# Altium project XE_BIA.PrjPcb
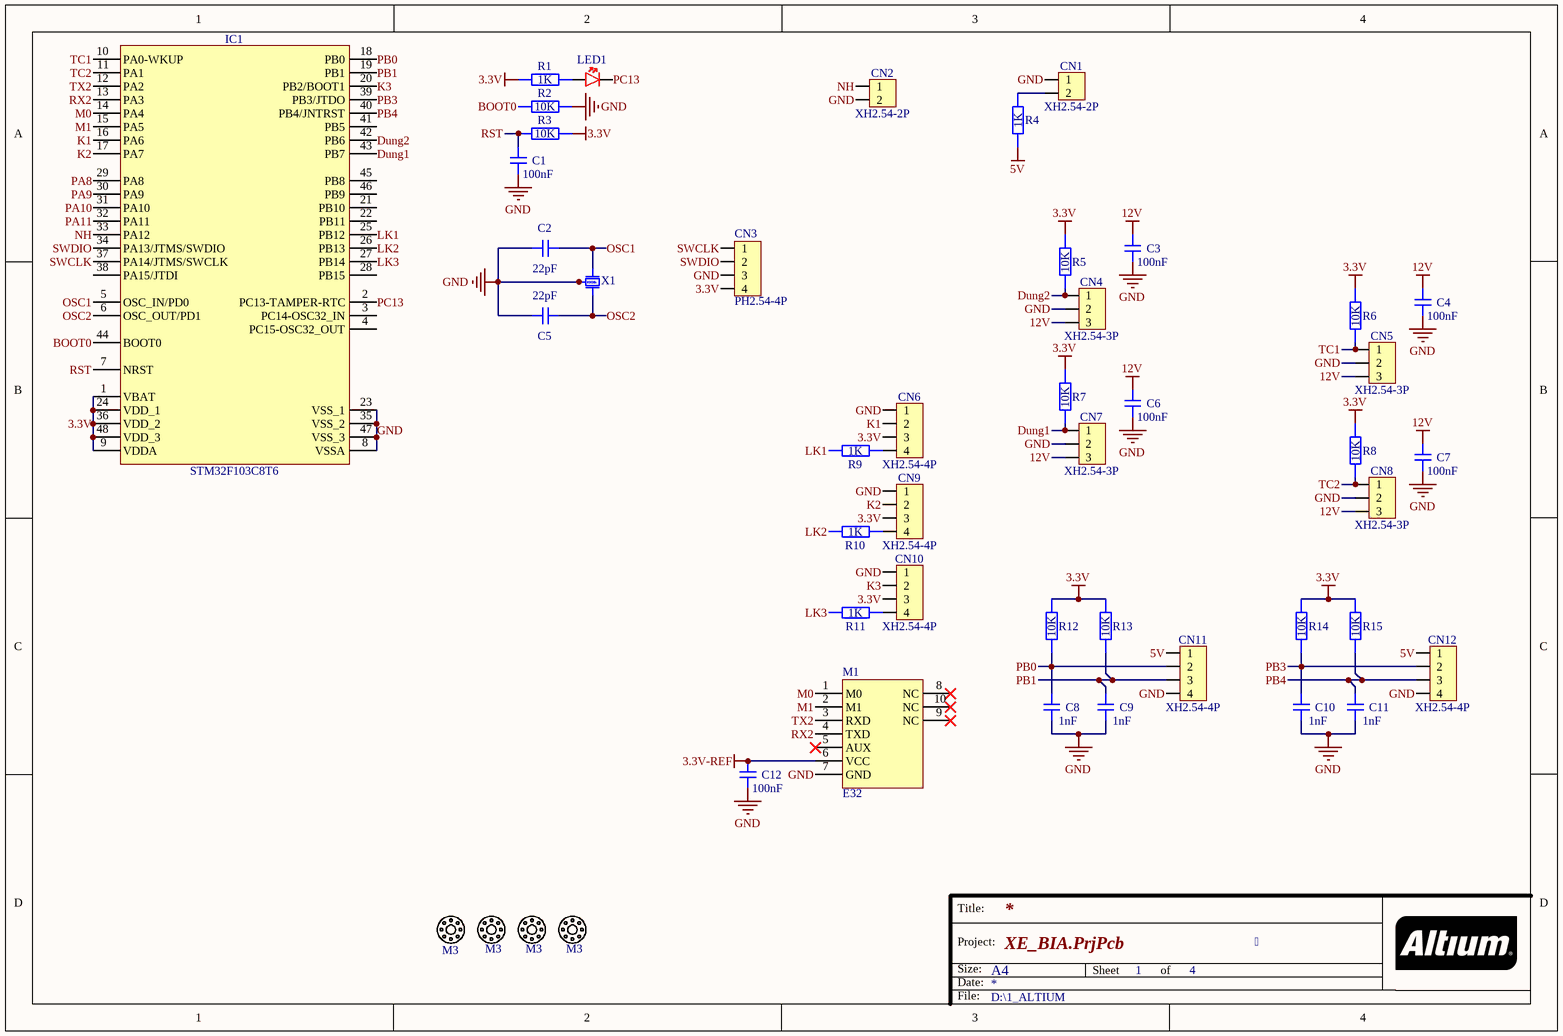
[diagram p0: MCU.SchDoc]
4 sheets, 139 parts. Net scope: global (net labels, ports and power ports of the same name join across sheets).
Board file: PCB.PcbDoc
Sheets:
  MCU.SchDoc
  PWR.SchDoc
  H_BRIGDE.SchDoc
  H_BRIGGE_1.SchDoc

## Sheet MCU.SchDoc
size A4; SheetNumber: 1; SheetTotal: 4

### Parts
1  M3  [Screw hole M3]
2  M3  [Screw hole M3]
3  M3  [Screw hole M3]
4  M3  [Screw hole M3]
C1  100nF  [CAP-0603-2]
C2  22pF  [CAP-0603-2]
C3  100nF  [CAP-0603-2]
C4  100nF  [CAP-0603-2]
C5  22pF  [CAP-0603-2]
C6  100nF  [CAP-0603-2]
C7  100nF  [CAP-0603-2]
C8  1nF  [CAP-0603-2]
C9  1nF  [CAP-0603-2]
C10  1nF  [CAP-0603-2]
C11  1nF  [CAP-0603-2]
C12  100nF  [CAP-0603-2]
CN1  XH2.54-2P  [Plugin,P=2.54mm,2P]
CN2  XH2.54-2P  [Plugin,P=2.54mm,2P]
CN3  PH2.54-4P  [Plugin,P=2.54mm,4P,Pin Headers]
CN4  XH2.54-3P  [Plugin,P=2.54mm,3P]
CN5  XH2.54-3P  [Plugin,P=2.54mm,3P]
CN6  XH2.54-4P  [Plugin,P=2.54mm,4P]
CN7  XH2.54-3P  [Plugin,P=2.54mm,3P]
CN8  XH2.54-3P  [Plugin,P=2.54mm,3P]
CN9  XH2.54-4P  [Plugin,P=2.54mm,4P]
CN10  XH2.54-4P  [Plugin,P=2.54mm,4P]
CN11  XH2.54-4P  [Plugin,P=2.54mm,4P]
CN12  XH2.54-4P  [Plugin,P=2.54mm,4P]
IC1  STM32F103C8T6  [LQFP-48(7x7)]
LED1  RED  [LED-0603]  (value not drawn)
M1  E32  [E32-TTL-100]
R1  1K  [RES-0603-1]
R2  10K  [RES-0603-1]
R3  10K  [RES-0603-1]
R4  1K  [RES-0603-1]
R5  10K  [RES-0603-1]
R6  10K  [RES-0603-1]
R7  10K  [RES-0603-1]
R8  10K  [RES-0603-1]
R9  1K  [RES-0603-1]
R10  1K  [RES-0603-1]
R11  1K  [RES-0603-1]
R12  10K  [RES-0603-1]
R13  10K  [RES-0603-1]
R14  10K  [RES-0603-1]
R15  10K  [RES-0603-1]
X1  8MHz  [SMD5032-4P]  (value not drawn)

### Nets
3.3V: CN3.4 CN6.3 CN9.3 CN10.3 IC1.1(VBAT) IC1.9(VDDA) IC1.24(VDD_1) IC1.36(VDD_2) IC1.48(VDD_3) R1.1 R3.2 R5.2 R6.2 R7.2 R8.2 R12.2 R13.2 R14.2 R15.2
3.3V-REF: C12.1 M1.6(VCC)
5V: CN11.1 CN12.1 R4.1
12V: C3.1 C4.1 C6.1 C7.1 CN4.3 CN5.3 CN7.3 CN8.3
GND: C1.2 C2.2 C3.2 C4.2 C5.2 C6.2 C7.2 C8.2 C9.2 C10.2 C11.2 C12.2 CN1.1 CN2.2 CN3.3 CN4.2 CN5.2 CN6.1 CN7.2 CN8.2 CN9.1 CN10.1 CN11.4 CN12.4 IC1.8(VSSA) IC1.23(VSS_1) IC1.35(VSS_2) IC1.47(VSS_3) M1.7(GND) R2.2 X1.2(GND) X1.4(GND)
BOOT0: IC1.44(BOOT0) R2.1
Dung1: CN7.1 IC1.43(PB7) R7.1
Dung2: CN4.1 IC1.42(PB6) R5.1
K1: CN6.2 IC1.16(PA6)
K2: CN9.2 IC1.17(PA7)
K3: CN10.2 IC1.20(PB2/BOOT1)
LK1: IC1.25(PB12) R9.1
LK2: IC1.26(PB13) R10.1
LK3: IC1.27(PB14) R11.1
M0: IC1.14(PA4) M1.1(M0)
M1: IC1.15(PA5) M1.2(M1)
NH: CN2.1 IC1.33(PA12)
OSC1: C2.1 IC1.5(OSC_IN/PD0) X1.1
OSC2: C5.1 IC1.6(OSC_OUT/PD1) X1.3
PA8: IC1.29(PA8)
PA9: IC1.30(PA9)
PA10: IC1.31(PA10)
PA11: IC1.32(PA11)
PB0: C8.1 CN11.2 IC1.18(PB0) R12.1
PB1: C9.1 CN11.3 IC1.19(PB1) R13.1
PB3: C10.1 CN12.2 IC1.39(PB3/JTDO) R14.1
PB4: C11.1 CN12.3 IC1.40(PB4/JNTRST) R15.1
PC13: IC1.2(PC13-TAMPER-RTC) LED1.2(K)
RST: C1.1 IC1.7(NRST) R3.1
RX2: IC1.13(PA3) M1.4(TXD)
SWCLK: CN3.1 IC1.37(PA14/JTMS/SWCLK)
SWDIO: CN3.2 IC1.34(PA13/JTMS/SWDIO)
TC1: CN5.1 IC1.10(PA0-WKUP) R6.1
TC2: CN8.1 IC1.11(PA1) R8.1
TX2: IC1.12(PA2) M1.3(RXD)
NetCN1_2: CN1.2 R4.2
NetCN6_4: CN6.4 R9.2
NetCN9_4: CN9.4 R10.2
NetCN10_4: CN10.4 R11.2
NetLED1_1: LED1.1(A) R1.2

Not connected (* = marked no-connect by the designer): IC1 3(PC14-OSC32_IN) 4(PC15-OSC32_OUT) 21(PB10) 22(PB11) 28(PB15) 38(PA15/JTDI) 41(PB5) 45(PB8) 46(PB9); M1 5(AUX)* 8(NC)* 9(NC)* 10(NC)*

### Notes on the sheet
- Title:
- Size:
- Date:
- Project:
- A4
- Sheet
- of
- File:
- D:\1_ALTIUM

### Library data of the parts
1-4 = Screw hole M3
C1 C3 C4 C6 C7 C12 = CL10B104KB8NNNC: 100nF ±10% 50V Ceramic Capacitor X7R 0603; Manufacturer: Samsung Electro-Mechanics; Package: 0603; LCSC Part #: C1591; Mfr.Part #: CL10B104KB8NNNC; DigiKey Part Number: 1276-1000-2-ND; ComponentLink1Description: Link; ComponentLink1URL: https://www.lcsc.com/product-detail/C1591.html?s_z=n_CL10B104KB8NNC; ComponentLink2Description: Link 1; ComponentLink2URL: https://www.digikey.com/en/products/detail/samsung-electro-mechanics/CL10B104KB8NNNC/3886658?s=N4IgTCBcDaIMIBkCMAGAQqgLAaTQDgDki4QBdAXyA
C2 C5 = CC0603JRNPO9BN220: 22pF ±5% 50V Ceramic Capacitor NP0 0603; Manufacturer: YAGEO; Package: 0603; LCSC Part #: C105620; Mfr.Part #: CC0603JRNPO9BN220; DigiKey Part Number: 311-1062-2-ND; ComponentLink1Description: Link; ComponentLink1URL: https://www.lcsc.com/product-detail/C105620.html?s_z=n_CC0603JRNPO9BN220; ComponentLink2Description: Link 1; ComponentLink2URL: https://www.digikey.com/en/products/detail/yageo/CC0603JRNPO9BN220/302796?s=N4IgTCBcDaIMJwAwDZEGYBSAlAcgBQHkBOAIRzDERAF0BfIA
C8-C11 = CC0603KRX7R9BB102: 1nF ±10% 50V Ceramic Capacitor X7R 0603; Manufacturer: YAGEO; Package: 0603; LCSC Part #: C100040; Mfr.Part #: CC0603KRX7R9BB102; DigiKey Part Number: 311-1080-2-ND; ComponentLink1Description: Link; ComponentLink1URL: https://www.lcsc.com/product-detail/C100040.html?s_z=n_C100040; ComponentLink2Description: Link 1; ComponentLink2URL: https://www.digikey.com/en/products/detail/yageo/CC0603KRX7R9BB102/302814?s=N4IgTCBcDaIMJwAwDZEGYDSAlAGgdiwE4AhYgRkQgF0BfIA
CN1 CN2 = BX-XH2.54-2PZZ: Connector Header 2 position 2.5mm Pitch 3A Through Hole -25℃~+85℃; Manufacturer: Bossie; Mfr.Part #: BX-XH2.54-2PZZ; LCSC Part #: C18077833; Package: Through Hole,P=2.5mm; DigiKey Part Number: NO; ComponentLink1Description: Link; ComponentLink1URL: https://www.lcsc.com/product-detail/C18077833.html?s_z=n_BX-XH2.54-2PZZ
CN3 = PH2.54-1X4P-H25: Pin Header 4 Position 2.54mm Pitch Single Row Through Hole -40℃~+105℃; Manufacturer: JXTCONN; Mfr.Part #: PH2.54-1X4P-H25; DigiKey Part Number: NO; Package: Plugin,P=2.54mm; LCSC Part #: C42431808
CN4 CN5 CN7 CN8 = BX-XH2.54-3PZZ: Connector Header 3 position 2.5mm Pitch 3A Through Hole -25℃~+85℃; Manufacturer: Bossie; Mfr.Part #: BX-XH2.54-3PZZ; LCSC Part #: C18077834; Package: Through Hole,P=2.5mm; DigiKey Part Number: NO; ComponentLink1Description: Link; ComponentLink1URL: https://www.lcsc.com/product-detail/C18077834.html?s_z=n_BX-XH2.54-3PZZ
CN6 CN9-CN12 = BX-XH2.54-4PZZ: Connector Header 4 position 2.5mm Pitch 3A Through Hole -25℃~+85℃; Manufacturer: Bossie; Mfr.Part #: BX-XH2.54-4PZZ; LCSC Part #: C18077835; Package: Through Hole,P=2.5mm; DigiKey Part Number: NO; ComponentLink1Description: Link; ComponentLink1URL: https://www.lcsc.com/product-detail/C18077835.html?s_z=n_BX-XH2.54-4PZZ
IC1 = STM32F103C8T6: ARM Cortex-M3 32 Bit 72MHz 37 LQFP-48(7x7) Microcontrollers RoHS; Manufacturer: ST; Mfr.Part #: STM32F103C8T6; Package: LQFP-48(7x7); LCSC Part #: C8734; DigiKey Part Number: 497-6063-ND; ComponentLink1Description: Link; ComponentLink1URL: https://www.lcsc.com/product-detail/C8734.html?s_z=n_STM32F103C8T6; ComponentLink2Description: Link 1; ComponentLink2URL: https://www.digikey.com/en/products/detail/stmicroelectronics/STM32F103C8T6/1646338
LED1 = YLED0603R: 25mA 1.8V~2.4V Red 0603 LED Indication - Discrete ROHS; Manufacturer: YONGYUTAI; Mfr.Part #: YLED0603R; Package: 0603; LCSC Part #: C19171390; DigiKey Part Number: NO; ComponentLink1Description: Link; ComponentLink1URL: https://www.lcsc.com/product-detail/C19171390.html?s_z=n_C19171390; ComponentLink2Description: Link 1
M1 = E32-TTL-100: E32-TTL-100 is a 100mW wireless transceiver module with LoRa / spread-spectrum technology, operates at 410~441MHz (Default: 433MHz), based on original imported RFIC SX1278 from SEMTECH; Manufacturer: Chengdu Ebyte Electronic; Mfr.Part #: E32-TTL-100; Package: Through Hole,P=2.54mm; LCSC Part #: NO; DigiKey Part Number: NO; ComponentLink1Description: Link; ComponentLink1URL: https://nshopvn.com/product/module-rf-sx1278-lora-e32/
R1 R4 R9-R11 = RC0603FR-071KL: 100mW 1kΩ 75V Thick Film Resistor ±100ppm/℃ ±1% 0603 Chip Resistor - Surface Mount RoHS; Manufacturer: YAGEO; Mfr.Part #: RC0603FR-071KL; Package: 0603; LCSC Part #: C22548; DigiKey Part Number: 311-1.00KHRTR-ND; ComponentLink1Description: Link; ComponentLink1URL: https://www.lcsc.com/product-detail/C22548.html?s_z=n_C22548; ComponentLink2Description: Link 1; ComponentLink2URL: https://www.digikey.com/en/products/detail/yageo/RC0603FR-071KL/726843?s=N4IgTCBcDaIEoGEAMA2JBmAYnAtEg7AIwDSAMiALoC%2BQA
R2 R3 R5-R8 R12-R15 = RC0603FR-0710KL: 100mW 10kΩ 75V Thick Film Resistor ±100ppm/℃ ±1% 0603 Chip Resistor - Surface Mount RoHS; Manufacturer: YAGEO; Package: 0603; LCSC Part #: C98220; Mfr.Part #: RC0603FR-0710KL; DigiKey Part Number: 311-10.0KHRTR-ND; ComponentLink1Description: Link; ComponentLink1URL: https://www.lcsc.com/product-detail/C98220.html?s_z=n_C98220; ComponentLink2Description: Link 1; ComponentLink2URL: https://www.digikey.com/en/products/detail/yageo/RC0603FR-0710KL/726880?s=N4IgTCBcDaIMwEYEFoEAYB0aDSAJASgCr7IByAIiALoC%2BQA
X1 = X50328MSB4SI: Crystal 8MHz ±10ppm 20pF SMD5032-4P; Manufacturer: YXC Crystal Oscillators; Mfr.Part #: X50328MSB4SI; Package: SMD5032-4P; LCSC Part #: C157341; DigiKey Part Number: NO; ComponentLink1Description: Link; ComponentLink1URL: https://www.lcsc.com/product-detail/C157341.html?s_z=n_c157341; ComponentLink2Description: Link 1

## Sheet PWR.SchDoc
size A4; SheetNumber: 2; SheetTotal: 4
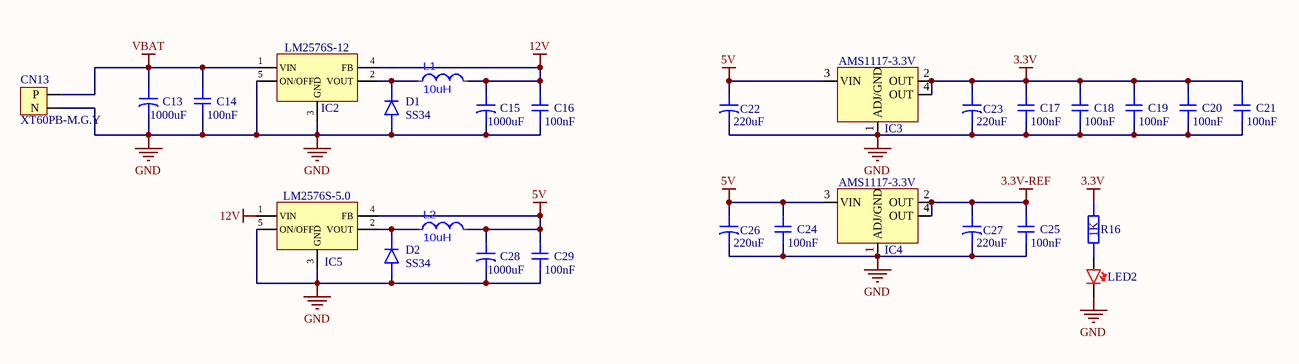
[diagram p1: PWR.SchDoc]

### Parts
C13  1000uF  [Plugin,D10xL20mm]
C14  100nF  [CAP-0603-2]
C15  1000uF  [Plugin,D10xL20mm]
C16  100nF  [CAP-0603-2]
C17  100nF  [CAP-0603-2]
C18  100nF  [CAP-0603-2]
C19  100nF  [CAP-0603-2]
C20  100nF  [CAP-0603-2]
C21  100nF  [CAP-0603-2]
C22  220uF  [PLUGIN,D6.3xL12mm]
C23  220uF  [PLUGIN,D6.3xL12mm]
C24  100nF  [CAP-0603-2]
C25  100nF  [CAP-0603-2]
C26  220uF  [PLUGIN,D6.3xL12mm]
C27  220uF  [PLUGIN,D6.3xL12mm]
C28  1000uF  [Plugin,D10xL20mm]
C29  100nF  [CAP-0603-2]
CN13  XT60PB-M.G.Y  [XT60PB-M.G.Y]
D1  SS34  [SMA(DO-214AC)]
D2  SS34  [SMA(DO-214AC)]
IC2  LM2576S-12  [TO-263-5L]
IC3  AMS1117-3.3V  [SOT-223]
IC4  AMS1117-3.3V  [SOT-223]
IC5  LM2576S-5.0  [TO-263-5L]
L1  10uH  [Inductor 4.5A 10uH 0630]
L2  10uH  [Inductor 4.5A 10uH 0630]
LED2  RED  [LED-0603]  (value not drawn)
R16  1K  [RES-0603-1]

### Nets
3.3V: C17.1 C18.1 C19.1 C20.1 C21.1 C23.1 IC3.2(OUT) IC3.4(OUT) R16.2
3.3V-REF: C25.1 C27.1 IC4.2(OUT) IC4.4(OUT)
5V: C22.1 C24.1 C26.1 C28.1 C29.1 IC3.3(VIN) IC4.3(VIN) IC5.4(FB) L2.2
12V: C15.1 C16.1 IC2.4(FB) IC5.1(VIN) L1.2
GND: C13.2 C14.2 C15.2 C16.2 C17.2 C18.2 C19.2 C20.2 C21.2 C22.2 C23.2 C24.2 C25.2 C26.2 C27.2 C28.2 C29.2 CN13.2(N) D1.1(A) D2.1(A) IC2.3(GND) IC2.5(ON/OFF) IC3.1(ADJ/GND) IC4.1(ADJ/GND) IC5.3(GND) IC5.5(ON/OFF) LED2.2(K)
VBAT: C13.1 C14.1 CN13.1(P) IC2.1(VIN)
NetD1_2: D1.2(K) IC2.2(VOUT) L1.1
NetD2_2: D2.2(K) IC5.2(VOUT) L2.1
NetLED2_1: LED2.1(A) R16.1

### Notes on the sheet
- Title:
- Size:
- Date:
- Project:
- A4
- Sheet
- of
- File:
- D:\1_ALTIUM

### Library data of the parts
C13 C15 C28 = 35PX1000MEFC10X20: 1000uF 35V Aluminum Electrolytic Capacitors Through Hole,D10xL20mm 2000hrs@105℃; Manufacturer: Rubycon; So_Chan_Cam: 2; Mfr.Part #: 35PX1000MEFC10X20; LCSC Part #: C136014; Package: Through Hole,D10xL20mm; DigiKey Part Number: 1189-1745-ND; ComponentLink1Description: Link; ComponentLink1URL: https://www.lcsc.com/product-detail/C136014.html?s_z=n_35PX1000MEFC10X20; ComponentLink2Description: Link 1; ComponentLink2URL: https://www.digikey.com/en/products/detail/rubycon/35PX1000MEFC10X20/3563769?s=N4IgTCBcDaIMwFYAKANAjABiwWQKIDEBhTFMDEAXQF8g
C14 C16-C21 C24 C25 C29 = CL10B104KB8NNNC: as C1 on sheet MCU; Package: 0603; LCSC Part #: C1591; Mfr.Part #: CL10B104KB8NNNC; DigiKey Part Number: 1276-1000-2-ND; ComponentLink1Description: Link; ComponentLink1URL: https://www.lcsc.com/product-detail/C1591.html?s_z=n_CL10B104KB8NNC; ComponentLink2Description: Link 1; ComponentLink2URL: https://www.digikey.com/en/products/detail/samsung-electro-mechanics/CL10B104KB8NNNC/3886658?s=N4IgTCBcDaIMIBkCMAGAQqgLAaTQDgDki4QBdAXyA
C22 C23 C26 C27 = 25YXJ220M6.3X11: 220uF 25V Aluminum Electrolytic Capacitors Through Hole,D6.3xL11mm 7000hrs@105℃; Manufacturer: Rubycon; Mfr.Part #: 25YXJ220M6.3X11; Package: Through Hole,D6.3xL11mm; LCSC Part #: C88729; DigiKey Part Number: 1189-2913-ND; ComponentLink1Description: Link; ComponentLink1URL: https://www.lcsc.com/product-detail/C88729.html; ComponentLink2Description: Link 1; ComponentLink2URL: https://www.digikey.com/en/products/detail/rubycon/25YXJ220M6-3X11/3563124?s=N4IgTCBcDa4KwE0AaApMYAMBZAbAOgGYkBGYkAXQF8g
CN13 = XT60PB-M.G.Y: Power Connectors RoHS; Manufacturer: Changzhou Amass Elec; Mfr.Part #: XT60PB-M.G.Y; LCSC Part #: C19268037; Package: Through Hole; DigiKey Part Number: NO; ComponentLink1Description: Link; ComponentLink1URL: https://www.lcsc.com/product-detail/C19268037.html?s_z=n_xt60; ComponentLink2Description: Link 1
D1 D2 = SS34: Diode Independent 40V 3A Surface Mount SMA(DO-214AC); Manufacturer: GOODWORK; Mfr.Part #: SS34; Package: SMA(DO-214AC); LCSC Part #: C908680; DigiKey Part Number: NO; ComponentLink1Description: Link; ComponentLink1URL: https://www.lcsc.com/product-detail/C908680.html?s_z=n_C908680
IC2 = LM2576S-12: Buck Switching Regulator IC Fixed 12V 1 Output 3A TO-263-5L; Manufacturer: HXY MOSFET; Mfr.Part #: LM2576S-12; Package: TO-263-5L; LCSC Part #: C22386541; DigiKey Part Number: NO
IC3 IC4 = AMS1117-3.3V: Linear Voltage Regulator IC Positive Fixed 1 Output 1A SOT-223; Manufacturer: MSKSEMI; Mfr.Part #: AMS1117-3.3V; Package: SOT-223; LCSC Part #: C5120765; DigiKey Part Number: NO; ComponentLink1Description: Link; ComponentLink1URL: https://www.lcsc.com/product-detail/C5120765.html?s_z=n_C5120765
IC5 = LM2576S-5.0: 47kHz~58kHz Buck Adjustable 3.5A 5V TO-263-5L Voltage Regulators - DC DC Switching Regulators RoHS; Manufacturer: HXY MOSFET; Mfr.Part #: LM2576S-5.0; Package: TO-263-5L; LCSC Part #: C5349983; DigiKey Part Number: NO; ComponentLink1Description: Link; ComponentLink1URL: https://www.lcsc.com/product-detail/C5349983.html?s_z=n_LM2576S-5.0; ComponentLink2Description: Link 1
L1 L2 = Inductor 4.5A 10uH 0630: 4.5A 10uH ±20% 5.5A 68mΩ Molded Inductor SMD,7.3x6.6mm Fixed Inductors RoHS; Manufacturer: Shun Xiang Nuo; MPN: SMMS0630-100M; Key Attributes: FIXED IND 10uH 68mΩ SMD,6.6x7.3mm; ComponentLink1Description: Link; ComponentLink1URL: https://www.lcsc.com/product-detail/C128692.html?s_z=n_q_l_inductor%25200630&spm=wm.fly.bg.1.xh___wm.fly.tp.0.ml&lcsc_vid=Q1VfX1ReRFFaUFJSRgIIUV0CFFgIBFJfT1hdVlwEEVkxVlNRTlNdX1VST1JcVTsOAxUeFF5JWBYZEEoKFBINSQcJGk4%3D; LCSC Part #: C128692; Packaging: SMD,7.3x6.6mm; Link: https://www.lcsc.com/product-detail/C128692.html?s_z=n_q_l_inductor%25200630&spm=wm.fly.bg.1.xh___wm.fly.tp.0.ml&lcsc_vid=Q1VfX1ReRFFaUFJSRgIIUV0CFFgIBFJfT1hdVlwEEVkxVlNRTlNdX1VST1JcVTsOAxUeFF5JWBYZEEoKFBINSQcJGk4%3D; Parameter 7: *
LED2 = YLED0603R: as LED1 on sheet MCU; Mfr.Part #: YLED0603R; Package: 0603; LCSC Part #: C19171390; DigiKey Part Number: NO; ComponentLink1Description: Link; ComponentLink1URL: https://www.lcsc.com/product-detail/C19171390.html?s_z=n_C19171390; ComponentLink2Description: Link 1
R16 = RC0603FR-071KL: as R1 on sheet MCU; Mfr.Part #: RC0603FR-071KL; Package: 0603; LCSC Part #: C22548; DigiKey Part Number: 311-1.00KHRTR-ND; ComponentLink1Description: Link; ComponentLink1URL: https://www.lcsc.com/product-detail/C22548.html?s_z=n_C22548; ComponentLink2Description: Link 1; ComponentLink2URL: https://www.digikey.com/en/products/detail/yageo/RC0603FR-071KL/726843?s=N4IgTCBcDaIEoGEAMA2JBmAYnAtEg7AIwDSAMiALoC%2BQA

## Sheet H_BRIGDE.SchDoc
size A4; SheetNumber: 3; SheetTotal: 4
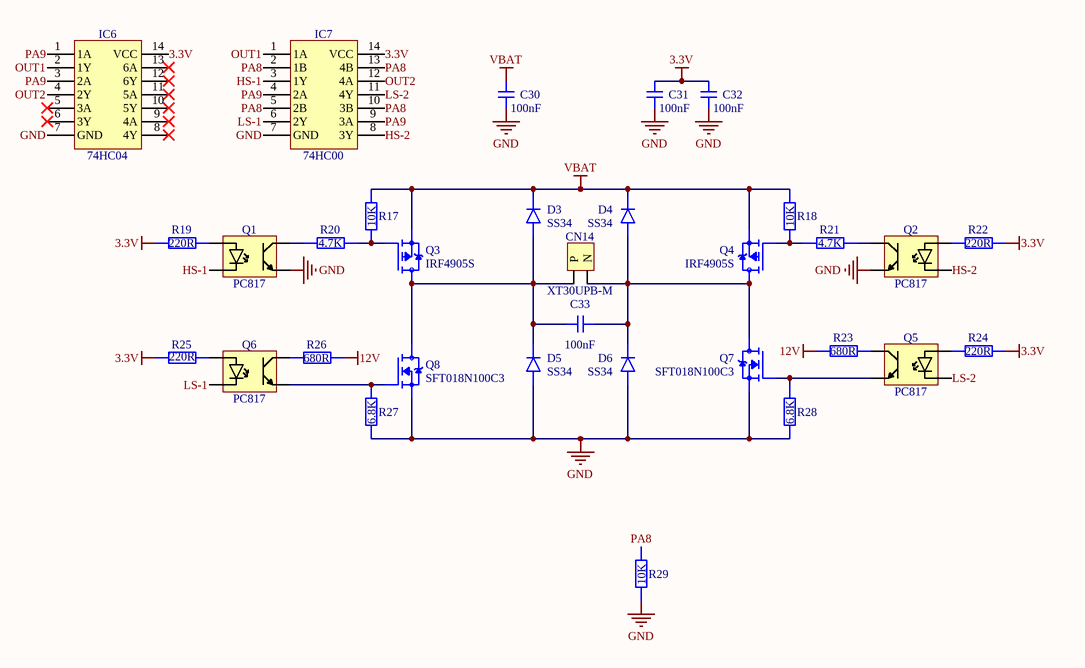
[diagram p2: H_BRIGDE.SchDoc]

### Parts
C30  100nF  [CAP-0603-2]
C31  100nF  [CAP-0603-2]
C32  100nF  [CAP-0603-2]
C33  100nF  [CAP-0603-2]
CN14  XT30UPB-M  [XT30UPB-M]
D3  SS34  [SMA(DO-214AC)]
D4  SS34  [SMA(DO-214AC)]
D5  SS34  [SMA(DO-214AC)]
D6  SS34  [SMA(DO-214AC)]
IC6  74HC04  [SOP-14]
IC7  74HC00  [SOP-14]
Q1  PC817  [SOP-4]
Q2  PC817  [SOP-4]
Q3  IRF4905S  [TO-263]
Q4  IRF4905S  [TO-263]
Q5  PC817  [SOP-4]
Q6  PC817  [SOP-4]
Q7  SFT018N100C3  [TOLL]
Q8  SFT018N100C3  [TOLL]
R17  10K  [RES-0603-1]
R18  10K  [RES-0603-1]
R19  220R  [RES-0603-1]
R20  4.7K  [RES-0603-1]
R21  4.7K  [RES-0603-1]
R22  220R  [RES-0603-1]
R23  680R  [RES-0603-1]
R24  220R  [RES-0603-1]
R25  220R  [RES-0603-1]
R26  680R  [RES-0603-1]
R27  6.8K  [RES-0603-1]
R28  6.8K  [RES-0603-1]
R29  10K  [RES-0603-1]

### Nets
3.3V: C31.1 C32.1 IC6.14(VCC) IC7.14(VCC) R19.2 R22.1 R24.1 R25.2
12V: R23.2 R26.2
GND: C30.2 C31.2 C32.2 D5.1(A) D6.1(A) IC6.7(GND) IC7.7(GND) Q1.3(E) Q2.3(E) Q7.2(S) Q8.2(S) R27.1 R28.1 R29.1
VBAT: C30.1 D3.2(K) D4.2(K) Q3.3(S) Q4.3(S) R17.2 R18.2
HS-1: IC7.3(1Y) Q1.2(K)
HS-2: IC7.8(3Y) Q2.2(K)
LS-1: IC7.6(2Y) Q6.2(K)
LS-2: IC7.11(4Y) Q5.2(K)
OUT1: IC6.2(1Y) IC7.1(1A)
OUT2: IC6.4(2Y) IC7.12(4A)
PA8: IC7.2(1B) IC7.5(2B) IC7.10(3B) IC7.13(4B) R29.2
PA9: IC6.1(1A) IC6.3(2A) IC7.4(2A) IC7.9(3A)
NetC33_1: C33.1 CN14.2(N) D4.1(A) D6.2(K) Q4.2(D) Q7.3(D)
NetC33_2: C33.2 CN14.1(P) D3.1(A) D5.2(K) Q3.2(D) Q8.3(D)
NetQ1_1: Q1.1(A) R19.1
NetQ1_4: Q1.4(C) R20.1
NetQ2_1: Q2.1(A) R22.2
NetQ2_4: Q2.4(C) R21.2
NetQ3_1: Q3.1(G) R17.1 R20.2
NetQ4_1: Q4.1(G) R18.1 R21.1
NetQ5_1: Q5.1(A) R24.2
NetQ5_3: Q5.3(E) Q7.1(G) R28.2
NetQ5_4: Q5.4(C) R23.1
NetQ6_1: Q6.1(A) R25.1
NetQ6_3: Q6.3(E) Q8.1(G) R27.2
NetQ6_4: Q6.4(C) R26.1

Not connected (* = marked no-connect by the designer): IC6 5(3A)* 6(3Y)* 8(4Y)* 9(4A)* 10(5Y)* 11(5A)* 12(6Y)* 13(6A)*

### Notes on the sheet
- Title:
- Size:
- Date:
- Project:
- A4
- Sheet
- of
- File:
- D:\1_ALTIUM

### Library data of the parts
C30-C33 = CL10B104KB8NNNC: as C1 on sheet MCU; Package: 0603; LCSC Part #: C1591; Mfr.Part #: CL10B104KB8NNNC; DigiKey Part Number: 1276-1000-2-ND; ComponentLink1Description: Link; ComponentLink1URL: https://www.lcsc.com/product-detail/C1591.html?s_z=n_CL10B104KB8NNC; ComponentLink2Description: Link 1; ComponentLink2URL: https://www.digikey.com/en/products/detail/samsung-electro-mechanics/CL10B104KB8NNNC/3886658?s=N4IgTCBcDaIMIBkCMAGAQqgLAaTQDgDki4QBdAXyA
CN14 = XT30UPB-M: Banana and Tip Connector Adapters; Manufacturer: Changzhou Amass Elec; Mfr.Part #: XT30PW-M30.G.Y; LCSC Part #: C428721; Package: Through Hole; DigiKey Part Number: NO; ComponentLink1Description: Link; ComponentLink1URL: https://www.lcsc.com/product-detail/C431092.html?s_z=n_xt30; ComponentLink2Description: Link 1
D3-D6 = SS34: as D1 on sheet PWR; Mfr.Part #: SS34; Package: SMA(DO-214AC); LCSC Part #: C908680; DigiKey Part Number: NO; ComponentLink1Description: Link; ComponentLink1URL: https://www.lcsc.com/product-detail/C908680.html?s_z=n_C908680
IC6 = SN74HC04DR: 2V~6V 16ns@6V,50pF 2uA 6 1 SOIC-14 Gates and Inverters RoHS; Manufacturer: TI; Mfr.Part #: SN74HC04DR; Package: SOIC-14; LCSC Part #: C6811; DigiKey Part Number: 296-1189-2-ND; ComponentLink1Description: Link; ComponentLink1URL: https://www.lcsc.com/product-detail/C6811.html?s_z=n_74HC04; ComponentLink2Description: Link 1; ComponentLink2URL: https://www.digikey.com/en/products/detail/texas-instruments/SN74HC04DR/276832
IC7 = SN74HC00DR: 2uA 2V~6V 15ns@6V,50pF SOIC-14 Gates and Inverters RoHS; Manufacturer: TI; Mfr.Part #: SN74HC00DR; Package: SOIC-14; LCSC Part #: C10090; DigiKey Part Number: 296-1187-2-ND; ComponentLink1Description: Link; ComponentLink1URL: https://www.lcsc.com/product-detail/C10090.html?s_z=n_74hc00; ComponentLink2Description: Link 1; ComponentLink2URL: https://www.digikey.com/en/products/detail/texas-instruments/SN74HC00DR/276830
Q1 Q2 Q5 Q6 = PC817C-S: Phototransistor Output 5kVrms 1 Channel SOP-4-2.54mm; Manufacturer: UMW; Mfr.Part #: PC817C-S; Package: SOP-4-2.54mm; LCSC Part #: C3008369; DigiKey Part Number: NO; ComponentLink1Description: Link; ComponentLink1URL: https://www.lcsc.com/product-detail/C3008369.html?s_z=n_C3008369; ComponentLink2Description: Link 1
Q3 Q4 = IRF4905STRLPBF: P-Channel 55V 70A 170W Surface Mount D2PAK; Manufacturer: Infineon; Package: D2PAK; Mfr.Part #: IRF4905STRLPBF; LCSC Part #: C2620; DigiKey Part Number: IRF4905STRLPBFTR-ND; ComponentLink1Description: Link; ComponentLink1URL: https://www.lcsc.com/product-detail/C2620.html?s_z=n_IRF4905S; ComponentLink2Description: Link 1; ComponentLink2URL: https://www.digikey.com/en/products/detail/infineon-technologies/IRF4905STRLPBF/1928283?s=N4IgTCBcDaIJICUBiAWAnABgKwGUAqCAMgAoBCSIAugL5A
Q7 Q8 = SFT018N100C3: N-Channel 100V 320A 312W Surface Mount TOLL; Manufacturer: SCILICON; Package: TOLL; Mfr.Part #: SFT018N100C3; LCSC Part #: C42395330; DigiKey Part Number: NO; ComponentLink1Description: Link; ComponentLink1URL: https://www.lcsc.com/product-detail/C42395330.html?s_z=n_c42395330; ComponentLink2Description: Link 1
R17 R18 R29 = RC0603FR-0710KL: as R2 on sheet MCU; Package: 0603; LCSC Part #: C98220; Mfr.Part #: RC0603FR-0710KL; DigiKey Part Number: 311-10.0KHRTR-ND; ComponentLink1Description: Link; ComponentLink1URL: https://www.lcsc.com/product-detail/C98220.html?s_z=n_C98220; ComponentLink2Description: Link 1; ComponentLink2URL: https://www.digikey.com/en/products/detail/yageo/RC0603FR-0710KL/726880?s=N4IgTCBcDaIMwEYEFoEAYB0aDSAJASgCr7IByAIiALoC%2BQA
R19 R22 R24 R25 = 0603WAF2200T5E: 220Ω ±1% 100mW 0603 Thick Film Resistor; Manufacturer: UNI-ROYAL; Mfr.Part #: 0603WAF2200T5E; Package: 0603; LCSC Part #: C22962; DigiKey Part Number: NO; ComponentLink1Description: Link; ComponentLink1URL: https://www.lcsc.com/product-detail/C22962.html?s_z=n_0603waf22; ComponentLink2Description: Link 1
R20 R21 = RC0603FR-074K7L: 100mW 4.7kΩ 75V Thick Film Resistor ±100ppm/℃ ±1% 0603 Chip Resistor - Surface Mount RoHS; Manufacturer: YAGEO; Mfr.Part #: RC0603FR-074K7L; Package: 0603; LCSC Part #: C99782; DigiKey Part Number: 311-4.70KHRTR-ND; ComponentLink1Description: Link; ComponentLink1URL: https://www.lcsc.com/product-detail/C99782.html?s_z=n_4.7K; ComponentLink2Description: Link 1; ComponentLink2URL: https://www.digikey.com/en/products/detail/yageo/RC0603FR-074K7L/727212?s=N4IgTCBcDaIEoGEAMA2JBmAYnAtEg7ACwDS%2BAMiALoC%2BQA
R23 R26 = FRC0603F6800TS: 680Ω ±1% 100mW 0603 Thick Film Resistor; Manufacturer: FOJAN; Mfr.Part #: FRC0603F6800TS; Package: 0603; LCSC Part #: C2907062; DigiKey Part Number: NO; ComponentLink1Description: Link; ComponentLink1URL: https://www.lcsc.com/product-detail/C2907062.html?s_z=n_680r; ComponentLink2Description: Link 1
R27 R28 = 0603WAF6801T5E: 6.8kΩ ±1% 100mW 0603 Thick Film Resistor; Manufacturer: UNI-ROYAL; Mfr.Part #: 0603WAF6801T5E; Package: 0603; LCSC Part #: C23212; DigiKey Part Number: NO; ComponentLink1Description: Link; ComponentLink1URL: https://www.lcsc.com/product-detail/C23212.html?s_z=n_C23212; ComponentLink2Description: Link 1

## Sheet H_BRIGGE_1.SchDoc
size A; SheetNumber: 4; SheetTotal: 4
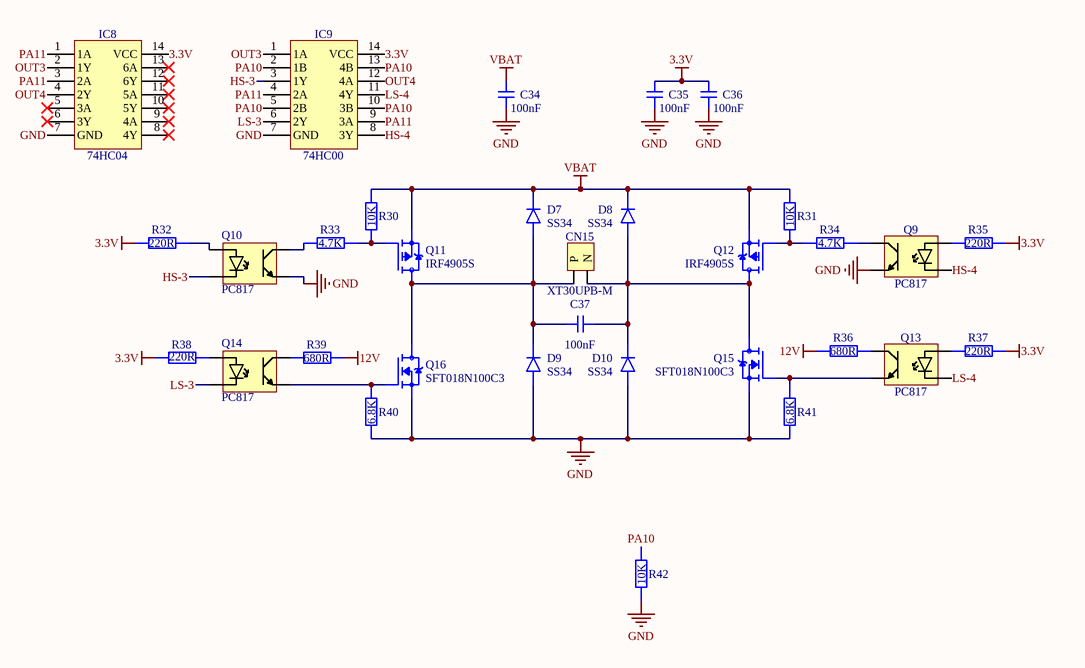
[diagram p3: H_BRIGGE_1.SchDoc]

### Parts
C34  100nF  [CAP-0603-2]
C35  100nF  [CAP-0603-2]
C36  100nF  [CAP-0603-2]
C37  100nF  [CAP-0603-2]
CN15  XT30UPB-M  [XT30UPB-M]
D7  SS34  [SMA(DO-214AC)]
D8  SS34  [SMA(DO-214AC)]
D9  SS34  [SMA(DO-214AC)]
D10  SS34  [SMA(DO-214AC)]
IC8  74HC04  [SOP-14]
IC9  74HC00  [SOP-14]
Q9  PC817  [SOP-4]
Q10  PC817  [SOP-4]
Q11  IRF4905S  [TO-263]
Q12  IRF4905S  [TO-263]
Q13  PC817  [SOP-4]
Q14  PC817  [SOP-4]
Q15  SFT018N100C3  [TOLL]
Q16  SFT018N100C3  [TOLL]
R30  10K  [RES-0603-1]
R31  10K  [RES-0603-1]
R32  220R  [RES-0603-1]
R33  4.7K  [RES-0603-1]
R34  4.7K  [RES-0603-1]
R35  220R  [RES-0603-1]
R36  680R  [RES-0603-1]
R37  220R  [RES-0603-1]
R38  220R  [RES-0603-1]
R39  680R  [RES-0603-1]
R40  6.8K  [RES-0603-1]
R41  6.8K  [RES-0603-1]
R42  10K  [RES-0603-1]

### Nets
3.3V: C35.1 C36.1 IC8.14(VCC) IC9.14(VCC) R32.2 R35.1 R37.1 R38.2
12V: R36.2 R39.2
GND: C34.2 C35.2 C36.2 D9.1(A) D10.1(A) IC8.7(GND) IC9.7(GND) Q9.3(E) Q10.3(E) Q15.2(S) Q16.2(S) R40.1 R41.1 R42.1
VBAT: C34.1 D7.2(K) D8.2(K) Q11.3(S) Q12.3(S) R30.2 R31.2
HS-3: IC9.3(1Y) Q10.2(K)
HS-4: IC9.8(3Y) Q9.2(K)
LS-3: IC9.6(2Y) Q14.2(K)
LS-4: IC9.11(4Y) Q13.2(K)
OUT3: IC8.2(1Y) IC9.1(1A)
OUT4: IC8.4(2Y) IC9.12(4A)
PA10: IC9.2(1B) IC9.5(2B) IC9.10(3B) IC9.13(4B) R42.2
PA11: IC8.1(1A) IC8.3(2A) IC9.4(2A) IC9.9(3A)
NetC37_1: C37.1 CN15.2(N) D8.1(A) D10.2(K) Q12.2(D) Q15.3(D)
NetC37_2: C37.2 CN15.1(P) D7.1(A) D9.2(K) Q11.2(D) Q16.3(D)
NetQ9_1: Q9.1(A) R35.2
NetQ9_4: Q9.4(C) R34.2
NetQ10_1: Q10.1(A) R32.1
NetQ10_4: Q10.4(C) R33.1
NetQ11_1: Q11.1(G) R30.1 R33.2
NetQ12_1: Q12.1(G) R31.1 R34.1
NetQ13_1: Q13.1(A) R37.2
NetQ13_3: Q13.3(E) Q15.1(G) R41.2
NetQ13_4: Q13.4(C) R36.1
NetQ14_1: Q14.1(A) R38.1
NetQ14_3: Q14.3(E) Q16.1(G) R40.2
NetQ14_4: Q14.4(C) R39.1

Not connected (* = marked no-connect by the designer): IC8 5(3A)* 6(3Y)* 8(4Y)* 9(4A)* 10(5Y)* 11(5A)* 12(6Y)* 13(6A)*

### Library data of the parts
C34-C37 = CL10B104KB8NNNC: as C1 on sheet MCU; Package: 0603; LCSC Part #: C1591; Mfr.Part #: CL10B104KB8NNNC; DigiKey Part Number: 1276-1000-2-ND; ComponentLink1Description: Link; ComponentLink1URL: https://www.lcsc.com/product-detail/C1591.html?s_z=n_CL10B104KB8NNC; ComponentLink2Description: Link 1; ComponentLink2URL: https://www.digikey.com/en/products/detail/samsung-electro-mechanics/CL10B104KB8NNNC/3886658?s=N4IgTCBcDaIMIBkCMAGAQqgLAaTQDgDki4QBdAXyA
CN15 = XT30UPB-M: as CN14 on sheet H_BRIGDE; LCSC Part #: C428721; Package: Through Hole; DigiKey Part Number: NO; ComponentLink1Description: Link; ComponentLink1URL: https://www.lcsc.com/product-detail/C431092.html?s_z=n_xt30; ComponentLink2Description: Link 1
D7-D10 = SS34: as D1 on sheet PWR; Mfr.Part #: SS34; Package: SMA(DO-214AC); LCSC Part #: C908680; DigiKey Part Number: NO; ComponentLink1Description: Link; ComponentLink1URL: https://www.lcsc.com/product-detail/C908680.html?s_z=n_C908680
IC8 = SN74HC04DR: as IC6 on sheet H_BRIGDE; Mfr.Part #: SN74HC04DR; Package: SOIC-14; LCSC Part #: C6811; DigiKey Part Number: 296-1189-2-ND; ComponentLink1Description: Link; ComponentLink1URL: https://www.lcsc.com/product-detail/C6811.html?s_z=n_74HC04; ComponentLink2Description: Link 1; ComponentLink2URL: https://www.digikey.com/en/products/detail/texas-instruments/SN74HC04DR/276832
IC9 = SN74HC00DR: as IC7 on sheet H_BRIGDE; Mfr.Part #: SN74HC00DR; Package: SOIC-14; LCSC Part #: C10090; DigiKey Part Number: 296-1187-2-ND; ComponentLink1Description: Link; ComponentLink1URL: https://www.lcsc.com/product-detail/C10090.html?s_z=n_74hc00; ComponentLink2Description: Link 1; ComponentLink2URL: https://www.digikey.com/en/products/detail/texas-instruments/SN74HC00DR/276830
Q9 Q10 Q13 Q14 = PC817C-S: as Q1 on sheet H_BRIGDE; Mfr.Part #: PC817C-S; Package: SOP-4-2.54mm; LCSC Part #: C3008369; DigiKey Part Number: NO; ComponentLink1Description: Link; ComponentLink1URL: https://www.lcsc.com/product-detail/C3008369.html?s_z=n_C3008369; ComponentLink2Description: Link 1
Q11 Q12 = IRF4905STRLPBF: as Q3 on sheet H_BRIGDE; Package: D2PAK; Mfr.Part #: IRF4905STRLPBF; LCSC Part #: C2620; DigiKey Part Number: IRF4905STRLPBFTR-ND; ComponentLink1Description: Link; ComponentLink1URL: https://www.lcsc.com/product-detail/C2620.html?s_z=n_IRF4905S; ComponentLink2Description: Link 1; ComponentLink2URL: https://www.digikey.com/en/products/detail/infineon-technologies/IRF4905STRLPBF/1928283?s=N4IgTCBcDaIJICUBiAWAnABgKwGUAqCAMgAoBCSIAugL5A
Q15 Q16 = SFT018N100C3: as Q7 on sheet H_BRIGDE; Package: TOLL; Mfr.Part #: SFT018N100C3; LCSC Part #: C42395330; DigiKey Part Number: NO; ComponentLink1Description: Link; ComponentLink1URL: https://www.lcsc.com/product-detail/C42395330.html?s_z=n_c42395330; ComponentLink2Description: Link 1
R30 R31 R42 = RC0603FR-0710KL: as R2 on sheet MCU; Package: 0603; LCSC Part #: C98220; Mfr.Part #: RC0603FR-0710KL; DigiKey Part Number: 311-10.0KHRTR-ND; ComponentLink1Description: Link; ComponentLink1URL: https://www.lcsc.com/product-detail/C98220.html?s_z=n_C98220; ComponentLink2Description: Link 1; ComponentLink2URL: https://www.digikey.com/en/products/detail/yageo/RC0603FR-0710KL/726880?s=N4IgTCBcDaIMwEYEFoEAYB0aDSAJASgCr7IByAIiALoC%2BQA
R32 R35 R37 R38 = 0603WAF2200T5E: as R19 on sheet H_BRIGDE; Mfr.Part #: 0603WAF2200T5E; Package: 0603; LCSC Part #: C22962; DigiKey Part Number: NO; ComponentLink1Description: Link; ComponentLink1URL: https://www.lcsc.com/product-detail/C22962.html?s_z=n_0603waf22; ComponentLink2Description: Link 1
R33 R34 = RC0603FR-074K7L: as R20 on sheet H_BRIGDE; Mfr.Part #: RC0603FR-074K7L; Package: 0603; LCSC Part #: C99782; DigiKey Part Number: 311-4.70KHRTR-ND; ComponentLink1Description: Link; ComponentLink1URL: https://www.lcsc.com/product-detail/C99782.html?s_z=n_4.7K; ComponentLink2Description: Link 1; ComponentLink2URL: https://www.digikey.com/en/products/detail/yageo/RC0603FR-074K7L/727212?s=N4IgTCBcDaIEoGEAMA2JBmAYnAtEg7ACwDS%2BAMiALoC%2BQA
R36 R39 = FRC0603F6800TS: as R23 on sheet H_BRIGDE; Mfr.Part #: FRC0603F6800TS; Package: 0603; LCSC Part #: C2907062; DigiKey Part Number: NO; ComponentLink1Description: Link; ComponentLink1URL: https://www.lcsc.com/product-detail/C2907062.html?s_z=n_680r; ComponentLink2Description: Link 1
R40 R41 = 0603WAF6801T5E: as R27 on sheet H_BRIGDE; Mfr.Part #: 0603WAF6801T5E; Package: 0603; LCSC Part #: C23212; DigiKey Part Number: NO; ComponentLink1Description: Link; ComponentLink1URL: https://www.lcsc.com/product-detail/C23212.html?s_z=n_C23212; ComponentLink2Description: Link 1

## Nets that join several sheets
3.3V: MCU (19 pins), PWR (9 pins), H_BRIGDE (8 pins), H_BRIGGE_1 (8 pins)
3.3V-REF: MCU (C12.1 M1.6), PWR (C25.1 C27.1 IC4.2 IC4.4)
5V: MCU (CN11.1 CN12.1 R4.1), PWR (9 pins)
12V: MCU (8 pins), PWR (5 pins), H_BRIGDE (R23.2 R26.2), H_BRIGGE_1 (R36.2 R39.2)
GND: MCU (32 pins), PWR (27 pins), H_BRIGDE (14 pins), H_BRIGGE_1 (14 pins)
VBAT: PWR (C13.1 C14.1 CN13.1 IC2.1), H_BRIGDE (7 pins), H_BRIGGE_1 (7 pins)
PA8: MCU (IC1.29), H_BRIGDE (5 pins)
PA9: MCU (IC1.30), H_BRIGDE (IC6.1 IC6.3 IC7.4 IC7.9)
PA10: MCU (IC1.31), H_BRIGGE_1 (5 pins)
PA11: MCU (IC1.32), H_BRIGGE_1 (IC8.1 IC8.3 IC9.4 IC9.9)